# EasyEDA schematic 1-Schematic_PhotoMag.json
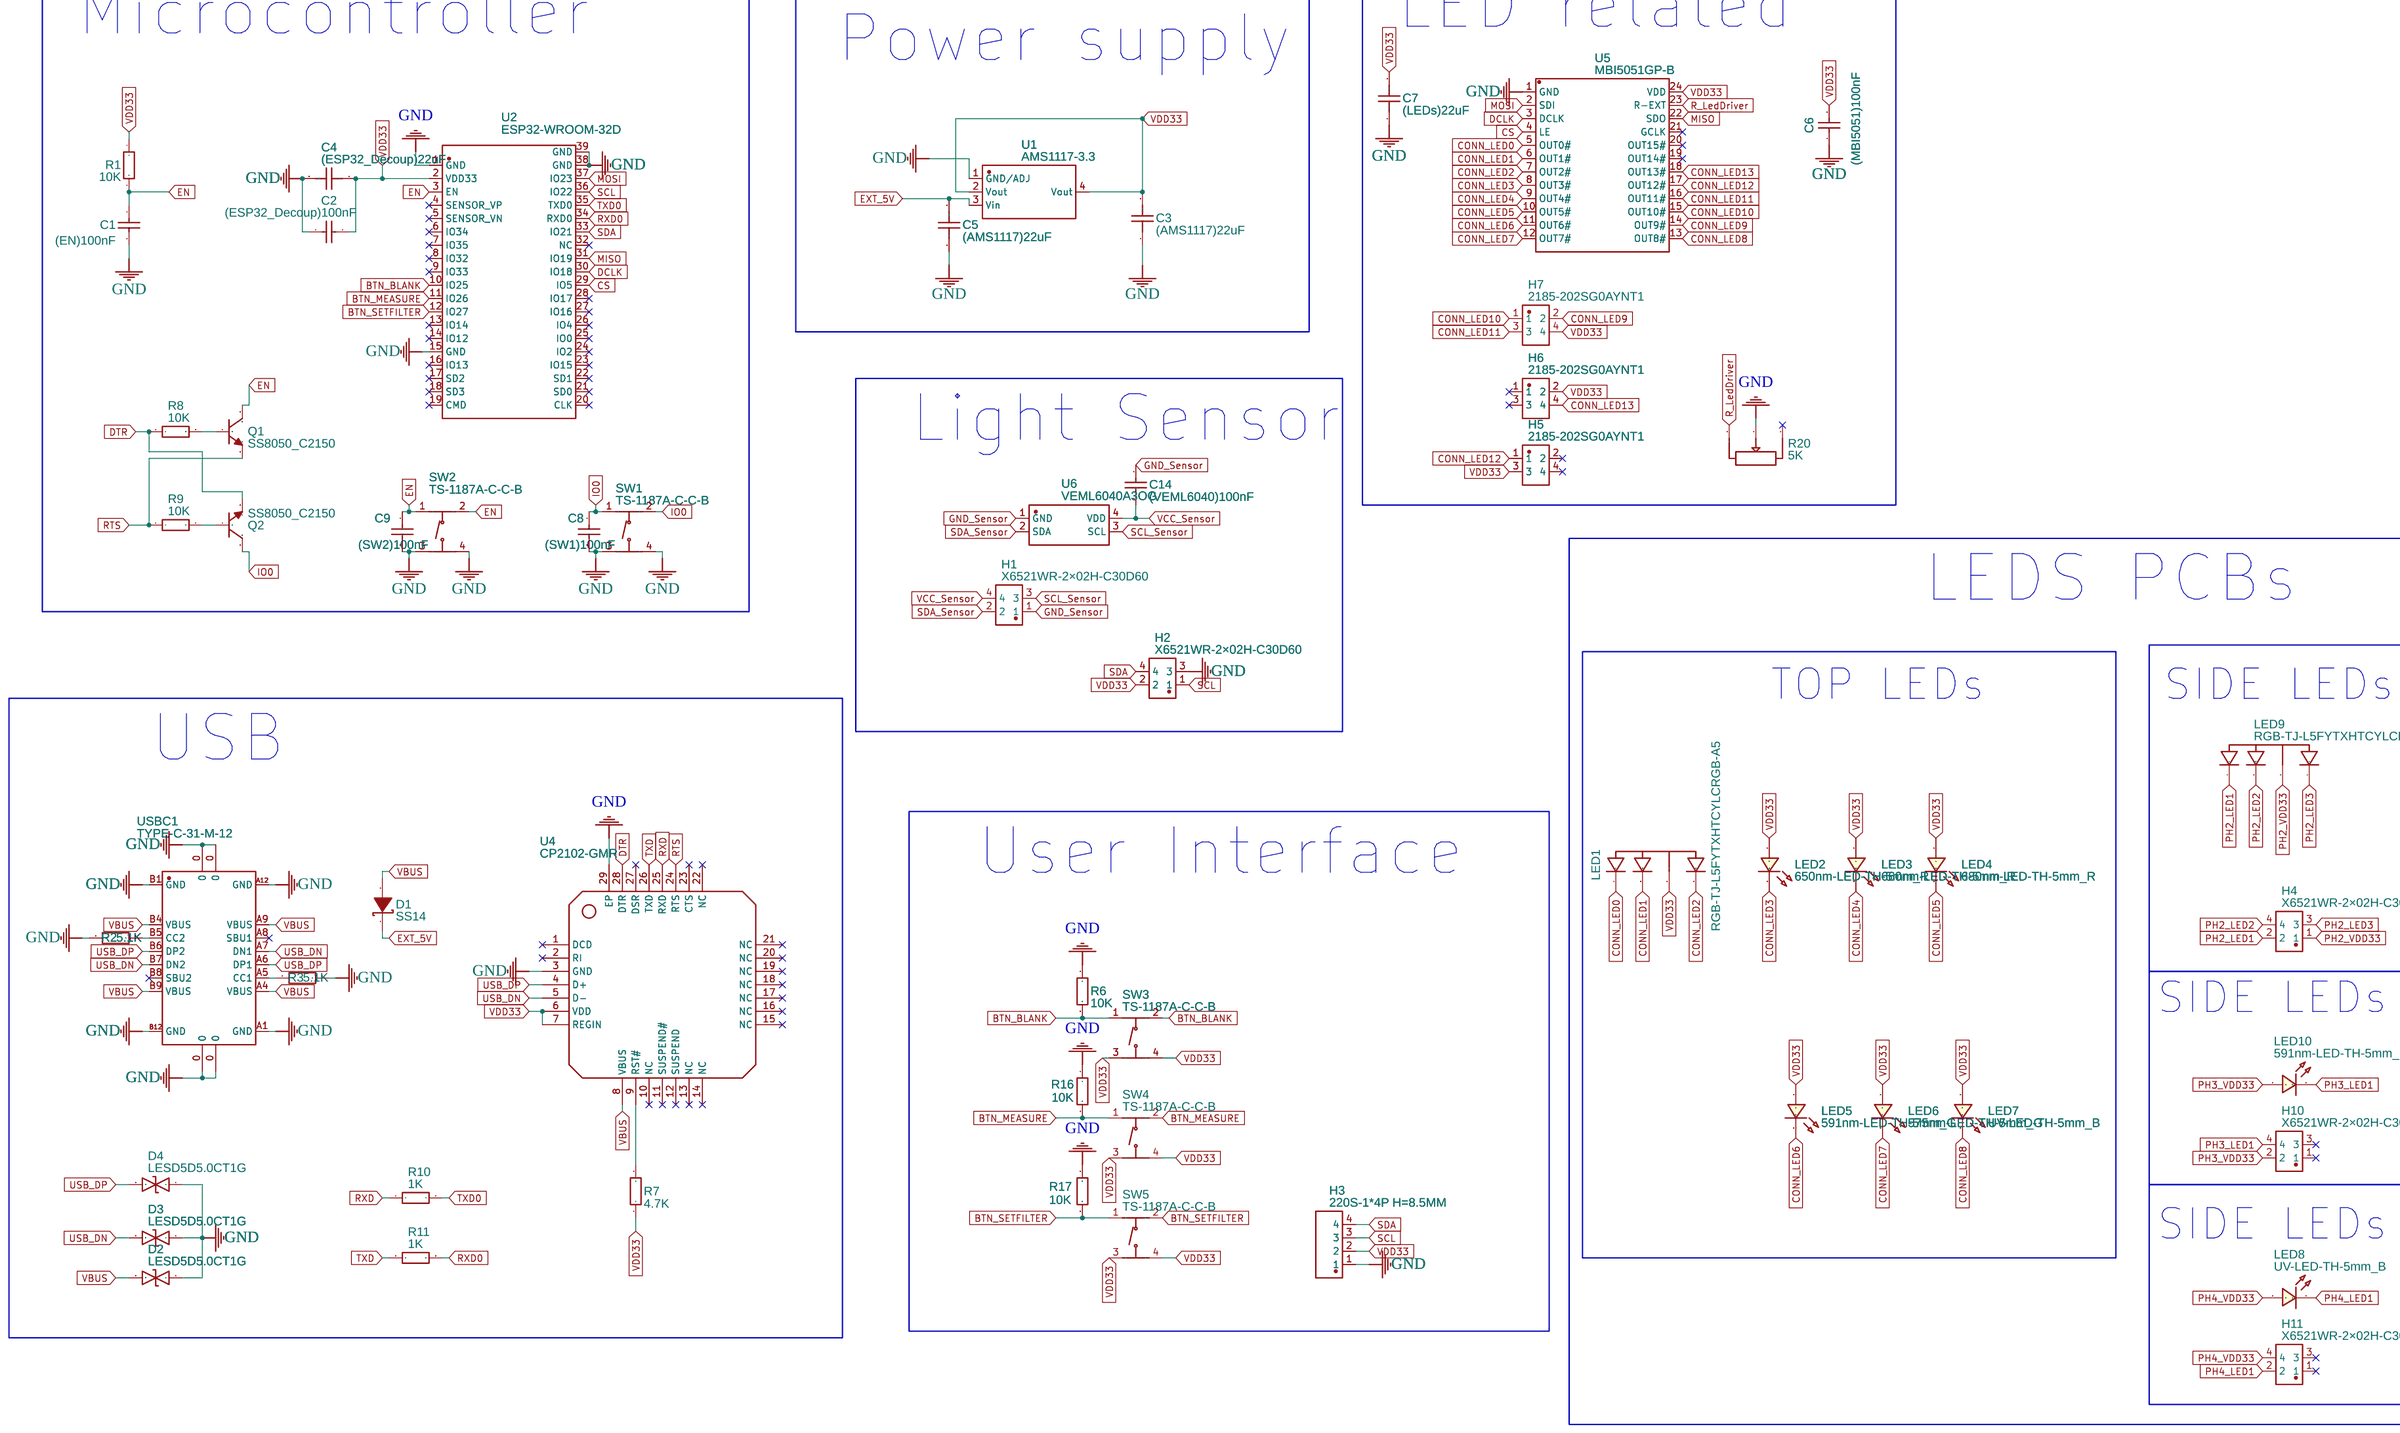
[diagram p0: schematic sheet]

## Parts
C1  (EN)100nF  [C1206]
C2  (ESP32_Decoup)100nF  [C1206]
C3  (AMS1117)22uF  [C0805]
C4  (ESP32_Decoup)22uF  [C0805]
C5  (AMS1117)22uF  [C0805]
C6  (MBI5051)100nF  [C1206]
C7  (LEDs)22uF  [C0805]
C8  (SW1)100nF  [C1206]
C9  (SW2)100nF  [C1206]
C14  (VEML6040)100nF  [C1206]
D1  SS14  [SMA_L4.4-W2.8-LS5.4-RD]
D2  LESD5D5.0CT1G  [SOD-523_L1.2-W0.8-LS1.6-BI]
D3  LESD5D5.0CT1G  [SOD-523_L1.2-W0.8-LS1.6-BI]
D4  LESD5D5.0CT1G  [SOD-523_L1.2-W0.8-LS1.6-BI]
H1  X6521WR-2×02H-C30D60  [HDR-TH_4P-P2.54-H-M-R2-C2-S2.54-W12.3-N]
H2  X6521WR-2×02H-C30D60  [HDR-TH_4P-P2.54-H-M-R2-C2-S2.54-W12.3-N]
H3  220S-1*4P H=8.5MM  [HDR-TH_4P-P2.54-V-F]
H4  X6521WR-2×02H-C30D60  [HDR-TH_4P-P2.54-H-M-R2-C2-S2.54-W12.3-N]
H5  2185-202SG0AYNT1  [HDR-TH_4P-P2.54-V-F-R2-C2-S2.54]
H6  2185-202SG0AYNT1  [HDR-TH_4P-P2.54-V-F-R2-C2-S2.54]
H7  2185-202SG0AYNT1  [HDR-TH_4P-P2.54-V-F-R2-C2-S2.54]
H10  X6521WR-2×02H-C30D60  [HDR-TH_4P-P2.54-H-M-R2-C2-S2.54-W12.3-N]
H11  X6521WR-2×02H-C30D60  [HDR-TH_4P-P2.54-H-M-R2-C2-S2.54-W12.3-N]
LED1  RGB-TJ-L5FYTXHTCYLCRGB-A5  [LED-TH_4P-BD5.8-P1.30]
LED2  650nm-LED-TH-5mm_R  [LED-TH_BD5.0_RED]
LED3  660nm-LED-TH-5mm_R  [LED-TH_BD5.0_RED]
LED4  680nm-LED-TH-5mm_R  [LED-TH_BD5.0_RED]
LED5  591nm-LED-TH-5mm_G  [LED-TH_BD5.0_GREEN]
LED6  575nm-LED-TH-5mm_G  [LED-TH_BD5.0_GREEN]
LED7  UV-LED-TH-5mm_B  [LED-TH_BD5.0_BLUE]
LED8  UV-LED-TH-5mm_B  [LED-TH_BD5.0_BLUE]
LED9  RGB-TJ-L5FYTXHTCYLCRGB-A5  [LED-TH_4P-BD5.8-P1.30]
LED10  591nm-LED-TH-5mm_R  [LED-TH_BD5.0_RED]
Q1  SS8050_C2150  [SOT-23-3_L2.9-W1.3-P1.90-LS2.4-BR]
Q2  SS8050_C2150  [SOT-23-3_L2.9-W1.3-P1.90-LS2.4-BR]
R1  10K  [R0805]
R2  5.1K  [R0805]
R3  5.1K  [R0805]
R6  10K  [R0805]
R7  4.7K  [R0805]
R8  10K  [R0805]
R9  10K  [R0805]
R10  1K  [R0603]
R11  1K  [R0603]
R16  10K  [R0805]
R17  10K  [R0805]
R20  5K  [RES-ADJ-TH_3266W]
SW1  TS-1187A-C-C-B  [SW-SMD_4P-L5.1-W5.1-P3.70-LS6.4]
SW2  TS-1187A-C-C-B  [SW-SMD_4P-L5.1-W5.1-P3.70-LS6.4]
SW3  TS-1187A-C-C-B  [SW-SMD_4P-L5.1-W5.1-P3.70-LS6.4]
SW4  TS-1187A-C-C-B  [SW-SMD_4P-L5.1-W5.1-P3.70-LS6.4]
SW5  TS-1187A-C-C-B  [SW-SMD_4P-L5.1-W5.1-P3.70-LS6.4]
U1  AMS1117-3.3  [SOT-223-3_L6.5-W3.4-P2.30-LS7.0-BR]
U2  ESP32-WROOM-32D  [WIFIM-SMD_39P-L25.5-W18.0-P1.27-BL]
U4  CP2102-GMR  [QFN-28_L5.0-W5.0-P0.50-BL-EP]
U5  MBI5051GP-B  [SSOP-24_L8.8-W4.0-P0.64-LS6.2-BL]
U6  VEML6040A3OG  [SENSOR_SMD_VEML6040A3OG]
USBC1  TYPE-C-31-M-12  [USB-C_SMD-TYPE-C-31-M-12]

## Library data of the parts
C1 C2 C6 C8 C9 C14 = CL31B104KBCNNNC: Supplier: LCSC; Manufacturer: SAMSUNG; Supplier Part: C24497; SMT Type: Basic; JLCPCB SMD: Yes; LCSC Assembly: Yes; Paste Type: base; JLCPCB Part Class: Basic Part
C3-C5 C7 = CL21A226MAQNNNE: Supplier: LCSC; Manufacturer: SAMSUNG; Supplier Part: C45783; SMT Type: Basic; JLCPCB SMD: Yes; LCSC Assembly: Yes; Paste Type: base; JLCPCB Part Class: Basic Part
D1 = SS14: Supplier: LCSC; Manufacturer: MDD; image: //image.lceda.cn/szlcsc/C2480.jpg; Supplier Part: C2480; SMT Type: Basic; JLCPCB SMD: Yes; LCSC Assembly: Yes; Paste Type: base; JLCPCB Part Class: Basic Part
D2-D4 = LESD5D5.0CT1G: Supplier: LCSC; Supplier Part: C383211; Manufacturer: Leshan Radio; Contributor: LCSC; SMT Type: Extend; JLCPCB SMD: Yes; LCSC Assembly: Yes; Paste Type: expand; JLCPCB Part Class: Extended Part
H1 H2 H4 H10 H11 = X6521WR-2×02H-C30D60: Supplier: LCSC; Supplier Part: C706883; Manufacturer: XKB Connectivity; Contributor: LCSC; JLCPCB Part Class: Extended Part
H3 = 220S-1*4P H=8.5MM: Supplier: LCSC; Manufacturer: Ckmtw; Manufacturer Part: 220S-1*4P H=8.5MM Ytype Gold-plated; Contributor: LCSC; Supplier Part: C124413; JLCPCB Part Class: Extended Part
H5-H7 = 2185-202SG0AYNT1: Supplier: LCSC; Supplier Part: C721791; Manufacturer: Wcon; Contributor: LCSC; JLCPCB Part Class: Extended Part
LED1 LED9 = TJ-L5FYTXHTCYLCRGB-A5: Supplier: LCSC; Supplier Part: C330749; Manufacturer: TOGIALED; Contributor: LCSC; JLCPCB Part Class: Extended Part
LED2-LED4 LED10 = LED-TH-5mm_R: Manufacturer: EVERLIGHT(台湾亿光); Manufacturer Part: 333-2SURD/S530-A3; Supplier Part: C87271; Supplier: LCSC; Contributor: LCEDA_Lib
LED5 LED6 = LED-TH-5mm_G: Manufacturer: EVERLIGHT(台湾亿光); Manufacturer Part: 333-2SYGD/S530-E2; Supplier Part: C88163; Supplier: LCSC; Contributor: LCEDA_Lib
LED7 LED8 = LED-TH-5mm_B: Supplier: LCSC; Contributor: LCEDA_Lib
Q1 Q2 = SS8050_C2150: Supplier: LCSC; Manufacturer: CJ; Manufacturer Part: SS8050; image: //image.lceda.cn/szlcsc/C2150.jpg; Supplier Part: C2150; SMT Type: Basic; JLCPCB SMD: Yes; LCSC Assembly: Yes; Paste Type: base; JLCPCB Part Class: Basic Part
R1 R6 R8 R9 R16 R17 = 0805W8F1002T5E: Supplier: LCSC; Manufacturer: UniOhm; Supplier Part: C17414; SMT Type: Basic; JLCPCB SMD: Yes; LCSC Assembly: Yes; Paste Type: base; JLCPCB Part Class: Basic Part
R2 R3 = 0805W8F5101T5E: Supplier: LCSC; Manufacturer: UniOhm; Supplier Part: C27834; JLCPCB Part Class: Basic Part
R7 = 0805W8F4701T5E: Supplier: LCSC; Manufacturer: UniOhm; Supplier Part: C17673; JLCPCB Part Class: Basic Part
R10 R11 = 0603WAF1001T5E: Supplier: LCSC; Manufacturer: UniOhm; Supplier Part: C21190; JLCPCB Part Class: Basic Part
R20 = 3266W-1-502: Supplier: LCSC; Supplier Part: C118905; Manufacturer: Chengdu Guosheng Tech; Contributor: LCSC; JLCPCB Part Class: Extended Part
SW1-SW5 = TS-1187A-C-C-B: Supplier: LCSC; Supplier Part: C318889; Manufacturer: XKB Enterprise; Contributor: LCSC; SMT Type: Extend; JLCPCB SMD: Yes; Paste Type: Extended Part; JLCPCB Part Class: Extended Part
U1 = AMS1117-3.3: sourceId: dwIGgezVh; Supplier: LCSC; Manufacturer: AMS; image: //image.lceda.cn/szlcsc/C6186.jpg; Supplier Part: C6186; SMT Type: Basic; JLCPCB SMD: Yes; LCSC Assembly: Yes; Paste Type: base; JLCPCB Part Class: Basic Part
U2 = ESP32-WROOM-32D: Supplier: LCSC; Supplier Part: C473012; Manufacturer: ESPRESSIF 乐鑫; Contributor: LCSC; JLCPCB Part Class: Extended Part
U4 = CP2102-GMR: Supplier: LCSC; Manufacturer: SILICON LABS; image: //image.lceda.cn/szlcsc/C6568.jpg; Supplier Part: C6568; SMT Type: Basic; JLCPCB SMD: Yes; LCSC Assembly: Yes; Paste Type: base; JLCPCB Part Class: Basic Part
U5 = MBI5051GP-B: Supplier: LCSC; Supplier Part: C261126; Manufacturer: MBI; Contributor: LCSC; JLCPCB Part Class: Extended Part
U6 = VEML6040A3OG: Supplier: LCSC; Supplier Part: C78465; Manufacturer: Vishay Intertech; Contributor: LCSC; JLCPCB Part Class: Extended Part
USBC1 = TYPE-C-31-M-12: Supplier: LCSC; Supplier Part: C165948; Manufacturer: Rectangular Connectors - Contacts; Contributor: LCSC; Paste Type: expand; JLCPCB Part Class: Extended Part

## Nets
GND: C1.2 C2.1 C3.1 C4.2 C5.1 C6.1 C7.1 C8.2 C9.2 D2.1 D3.1 D4.1 H2.3 H3.1 R2.2 R3.1 R6.1 R16.1 R17.1 R20.2 SW1.3(C) SW1.4(D) SW2.3(C) SW2.4(D) U1.1(GND/ADJ) U2.1(GND) U2.15(GND) U2.38(GND) U2.39(GND) U4.3(GND) U4.29(EP) U5.1(GND) USBC1.0 USBC1.A1(GND) USBC1.A12(GND) USBC1.B1(GND) USBC1.B12(GND)
GND_Sensor: C14.2 H1.1 U6.1(GND)
VBUS: D1.2(A) D2.2 U4.8(VBUS) USBC1.A4(VBUS) USBC1.A9(VBUS) USBC1.B4(VBUS) USBC1.B9(VBUS)
VCC_Sensor: C14.1 H1.4 U6.4(VDD)
VDD33: C2.2 C3.2 C4.1 C6.2 C7.2 H2.2 H3.2 H5.3 H6.2 H7.4 LED1.2(+) LED2.1 LED3.1 LED4.1 LED5.1 LED6.1 LED7.1 R1.1 R7.1 SW3.3(C) SW3.4(D) SW4.3(C) SW4.4(D) SW5.3(C) SW5.4(D) U1.2(Vout) U1.4(Vout) U2.2(VDD33) U4.6(VDD) U4.7(REGIN) U5.24(VDD)
BTN_BLANK: R6.2 SW3.1(A) SW3.2(B) U2.10(IO25)
BTN_MEASURE: R16.2 SW4.1(A) SW4.2(B) U2.11(IO26)
BTN_SETFILTER: R17.2 SW5.1(A) SW5.2(B) U2.12(IO27)
CONN_LED0: LED1.4 U5.5(OUT0#)
CONN_LED1: LED1.3 U5.6(OUT1#)
CONN_LED2: LED1.1 U5.7(OUT2#)
CONN_LED3: LED2.2 U5.8(OUT3#)
CONN_LED4: LED3.2 U5.9(OUT4#)
CONN_LED5: LED4.2 U5.10(OUT5#)
CONN_LED6: LED5.2 U5.11(OUT6#)
CONN_LED7: LED6.2 U5.12(OUT7#)
CONN_LED8: LED7.2 U5.13(OUT8#)
CONN_LED9: H7.2 U5.14(OUT9#)
CONN_LED10: H7.1 U5.15(OUT10#)
CONN_LED11: H7.3 U5.16(OUT11#)
CONN_LED12: H5.1 U5.17(OUT12#)
CONN_LED13: H6.4 U5.18(OUT13#)
CS: U2.29(IO5) U5.4(LE)
DCLK: U2.30(IO18) U5.3(DCLK)
DTR: Q2.2(E) R8.1 U4.28(DTR)
EN: C1.1 C9.1 Q1.3(C) R1.2 SW2.1(A) SW2.2(B) U2.3(EN)
EXT_5V: C5.2 D1.1(K) U1.3(Vin)
IO0: C8.1 Q2.3(C) SW1.1(A) SW1.2(B)
MISO: U2.31(IO19) U5.22(SDO)
MOSI: U2.37(IO23) U5.2(SDI)
PH2_LED1: H4.2 LED9.4
PH2_LED2: H4.4 LED9.3
PH2_LED3: H4.3 LED9.1
PH2_VDD33: H4.1 LED9.2(+)
PH3_LED1: H10.4 LED10.2
PH3_VDD33: H10.2 LED10.1
PH4_LED1: H11.2 LED8.2
PH4_VDD33: H11.4 LED8.1
R_LedDriver: R20.3 U5.23(R-EXT)
RTS: Q1.2(E) R9.1 U4.24(RTS)
RXD: R10.1 U4.25(RXD)
RXD0: R11.2 U2.34(RXD0)
SCL: H2.1 H3.3 U2.36(IO22)
SCL_Sensor: H1.3 U6.3(SCL)
SDA: H2.4 H3.4 U2.33(IO21)
SDA_Sensor: H1.2 U6.2(SDA)
TXD: R11.1 U4.26(TXD)
TXD0: R10.2 U2.35(TXD0)
USB_DN: D3.2 U4.5(D-) USBC1.A7(DN1) USBC1.B7(DN2)
USB_DP: D4.2 U4.4(D+) USBC1.A6(DP1) USBC1.B6(DP2)
Net-(Q1-1): Q1.1(B) R8.2
Net-(Q2-1): Q2.1(B) R9.2
Net-(R2-1): R2.1 USBC1.B5(CC2)
Net-(R3-2): R3.2 USBC1.A5(CC1)
Net-(R7-2): R7.2 U4.9(RST#)

Not connected (* = marked no-connect by the designer): H5 2* 4*; H6 1* 3*; H10 1* 3*; H11 1* 3*; R20 1*; U2 4(SENSOR_VP)* 5(SENSOR_VN)* 6(IO34)* 7(IO35)* 8(IO32)* 9(IO33)* 13(IO14)* 14(IO12)* 16(IO13)* 17(SD2)* 18(SD3)* 19(CMD)* 20(CLK)* 21(SD0)* 22(SD1)* 23(IO15)* 24(IO2)* 25(IO0)* 26(IO4)* 27(IO16)* 28(IO17)* 32(NC)*; U4 1(DCD)* 2(RI)* 10(NC)* 11(SUSPEND#)* 12(SUSPEND)* 13(NC)* 14(NC)* 15(NC)* 16(NC)* 17(NC)* 18(NC)* 19(NC)* 20(NC)* 21(NC)* 22(NC)* 23(CTS)* 27(DSR)*; U5 19(OUT14#)* 20(OUT15#)* 21(GCLK)*; USBC1 A8(SBU1)* B8(SBU2)*

## Notes on the sheet
- Microcontroller
- LED related
- Power supply
- Light Sensor
- LEDS PCBs
- TOP LEDs
- SIDE LEDs #1
- USB
- User Interface
- SIDE LEDs #2
- SIDE LEDs #3
